# Altium schematic sheet pca10095_sheet2_nrf5340_mcu.SchDoc: PCA10095 - nRF5340 MCU
size A3; Organization: Nordic Semiconductor; DocumentNumber: 2; SheetNumber: 2; SheetTotal: 6; CompanyName: Nordic Semiconductor
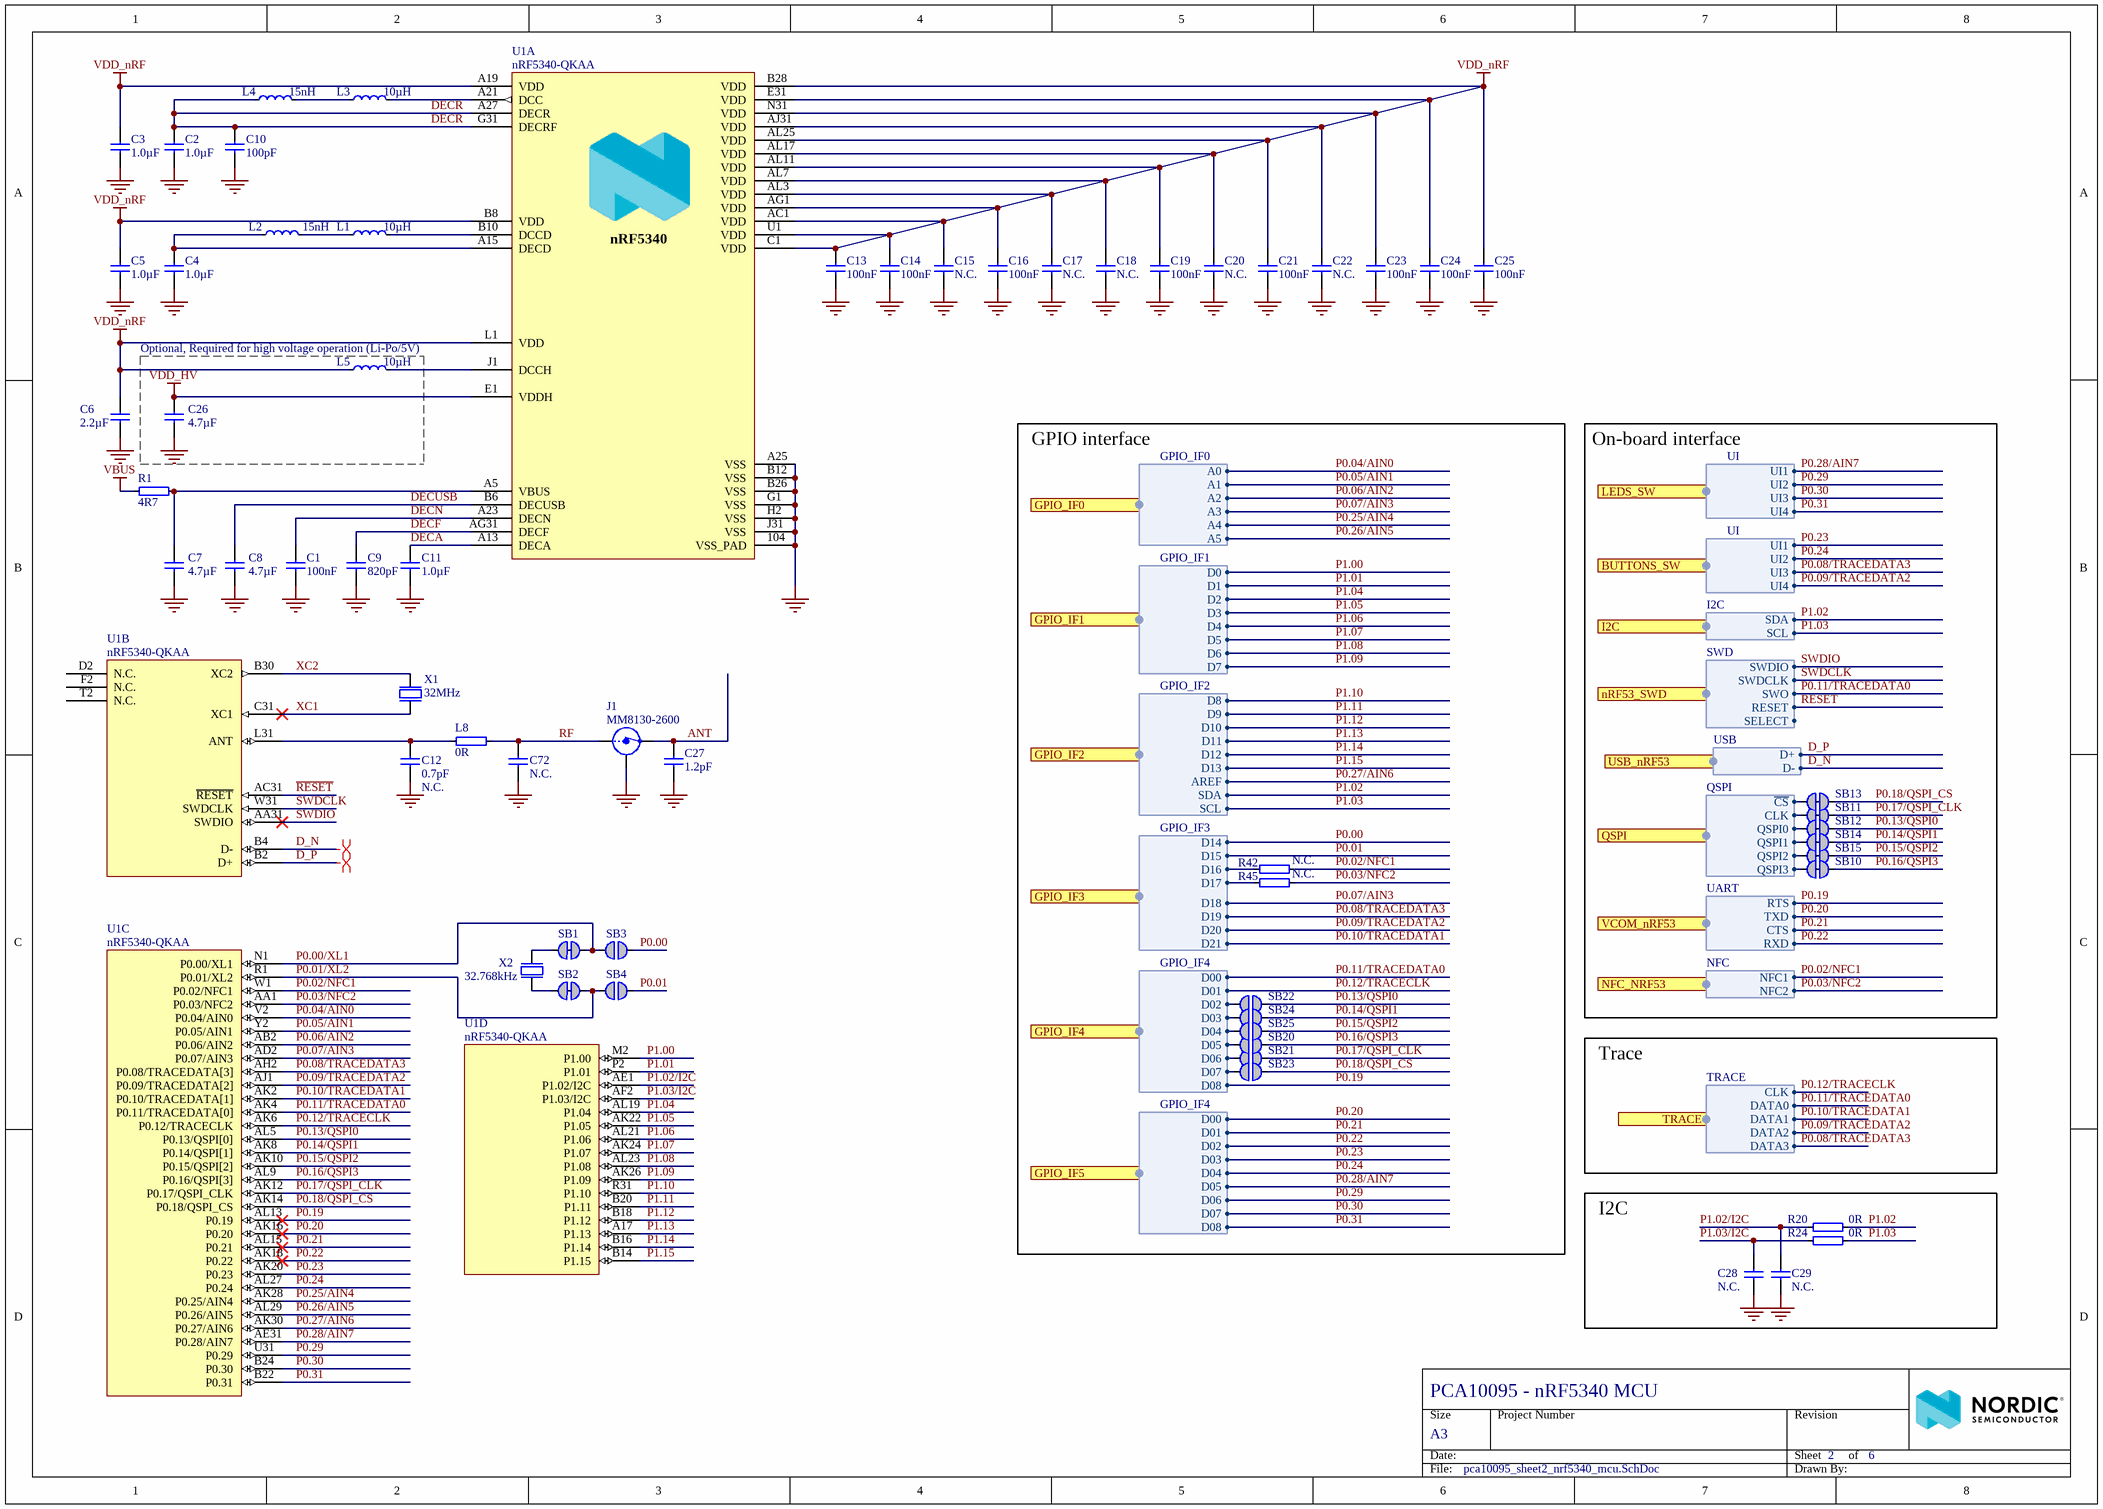
[diagram p0: pca10095_sheet2_nrf5340_mcu.SchDoc]

## Parts
C1  100nF  [CAPC0603X03L_C]
C2  1.0µF  [CAPC1005X04L]
C3  1.0µF  [CAPC1005X04L]
C4  1.0µF  [CAPC1005X04L]
C5  1.0µF  [CAPC1005X04L]
C6  2.2µF  [CAPC1608X06L]
C7  4.7µF  [CAPC1608X06L]
C8  4.7µF  [CAPC1608X06L]
C9  820pF  [CAPC0603X03L_C]
C10  100pF  [CAPC0603X03L_C]
C11  1.0µF  [CAPC1005X04L]
C12  0.7pF  Assembly: N.C.  [CAPC0603X03L_C]
C13  100nF  [CAPC0603X03L_C]
C14  100nF  [CAPC0603X03L_C]
C15  N.C.  [CAPC0603X03L_C]
C16  100nF  [CAPC0603X03L_C]
C17  N.C.  [CAPC0603X03L_C]
C18  N.C.  [CAPC0603X03L_C]
C19  100nF  [CAPC0603X03L_C]
C20  N.C.  [CAPC0603X03L_C]
C21  100nF  [CAPC0603X03L_C]
C22  N.C.  [CAPC0603X03L_C]
C23  100nF  [CAPC0603X03L_C]
C24  100nF  [CAPC0603X03L_C]
C25  100nF  [CAPC0603X03L_C]
C26  4.7µF  [CAPC1608X06L]
C27  1.2pF  [CAPC1005X04L]
C28  N.C.  [CAPC0603X03L_C]
C29  N.C.  [CAPC0603X03L_C]
C72  N.C.  [CAPC0603X03L_C]
J1  MM8130-2600  [COAXIAL-SWF]
L1  10µH  [INDC1608X06L]
L2  15nH  [INDC0603X03L_C]
L3  10µH  [INDC1608X06L]
L4  15nH  [INDC0603X03L_C]
L5  10µH  [INDC1608X06L]
L8  0R  [RESC0603X03L_C]
R1  4R7  [RESC0603X03L_C]
R20  0R  [RESC0603X03L_C]
R24  0R  [RESC0603X03L_C]
R42  N.C.  [RESC0603X03L_C]
R45  N.C.  [RESC0603X03L_C]
SB1  Solderbridge  [Solderbridge_Shorted]  (value not drawn)  (net tie, no BOM)
SB2  Solderbridge  [Solderbridge_Shorted]  (value not drawn)  (net tie, no BOM)
SB3  Solderbridge  [Solderbridge]  (value not drawn)  (no BOM)
SB4  Solderbridge  [Solderbridge]  (value not drawn)  (no BOM)
SB10  Solderbridge  [Solderbridge_Shorted]  (value not drawn)  (net tie, no BOM)
SB11  Solderbridge  [Solderbridge_Shorted]  (value not drawn)  (net tie, no BOM)
SB12  Solderbridge  [Solderbridge_Shorted]  (value not drawn)  (net tie, no BOM)
SB13  Solderbridge  [Solderbridge_Shorted]  (value not drawn)  (net tie, no BOM)
SB14  Solderbridge  [Solderbridge_Shorted]  (value not drawn)  (net tie, no BOM)
SB15  Solderbridge  [Solderbridge_Shorted]  (value not drawn)  (net tie, no BOM)
SB20  Solderbridge  [Solderbridge]  (value not drawn)  (no BOM)
SB21  Solderbridge  [Solderbridge]  (value not drawn)  (no BOM)
SB22  Solderbridge  [Solderbridge]  (value not drawn)  (no BOM)
SB23  Solderbridge  [Solderbridge]  (value not drawn)  (no BOM)
SB24  Solderbridge  [Solderbridge]  (value not drawn)  (no BOM)
SB25  Solderbridge  [Solderbridge]  (value not drawn)  (no BOM)
U1  nRF5340-QKAA  [AQFN40P700X700X85_HS-99N]  (parts A,B,C,D of 4)
X1  32MHz  [BT-XTAL_2016]
X2  32.768kHz  [XTAL_2012]

## Blocks framed on the sheet
Optional, Required for high voltage operation (Li-Po/5V): C26 L5
GPIO interface: R42 R45 SB20-SB25
On-board interface: SB10-SB15
I2C: C28 C29 R20 R24

## Ports
BUTTONS_SW (harness UI), GPIO_IF0 (harness GPIO_IF0), GPIO_IF1 (harness GPIO_IF1), GPIO_IF2 (harness GPIO_IF2), GPIO_IF3 (harness GPIO_IF3), GPIO_IF4 (harness GPIO_IF4), GPIO_IF5 (harness GPIO_IF4), I2C (harness I2C), LEDS_SW (harness UI), NFC_NRF53 (harness NFC), nRF53_SWD (harness SWD), QSPI (harness QSPI), TRACE (harness TRACE), USB_nRF53 (harness USB), VCOM_nRF53 (harness UART)

## Harnesses
QSPI: ~{CS}, QSPI0, CLK, QSPI1, QSPI2, QSPI3
SWD: SWDIO, SWDCLK, SWO, RESET, SELECT
UI: UI4, UI3, UI2, UI1
USB: D+, D-
TRACE: CLK, DATA0, DATA1, DATA3, DATA2
NFC: NFC2, NFC1
UART: RTS, CTS, RXD, TXD
GPIO_IF1: D0, D1, D2, D3, D4, D5, D6, D7
GPIO_IF2: D8, D9, D10, D11, D12, D13, AREF, SDA, SCL
GPIO_IF0: A0, A1, A2, A3, A4, A5
GPIO_IF3: D14, D15, D16, D17, D18, D19, D20, D21
I2C: SCL, SDA
GPIO_IF4: D00, D01, D02, D03, D04, D05, D06, D07, D08

## Nets
GND: C1.2 C2.1 C3.2 C4.1 C5.1 C6.2 C7.2 C8.2 C9.1 C10.2 C11.1 C12.1 C13.2 C14.2 C15.2 C16.2 C17.2 C18.2 C19.2 C20.2 C21.2 C22.2 C23.2 C24.2 C25.2 C26.2 C27.2 C28.1 C29.1 C72.1 J1.2(Shield) U1.104(VSS_PAD) U1.A25(VSS) U1.B12(VSS) U1.B26(VSS) U1.G1(VSS) U1.H2(VSS) U1.J31(VSS) X1.2(GND) X1.4(GND)
VBUS: R1.1
VDD_HV: C26.1 U1.E1(VDDH)
VDD_nRF: C3.1 C5.2 C6.1 C13.1 C14.1 C15.1 C16.1 C17.1 C18.1 C19.1 C20.1 C21.1 C22.1 C23.1 C24.1 C25.1 L5.1 U1.A19(VDD) U1.AC1(VDD) U1.AG1(VDD) U1.AJ31(VDD) U1.AL3(VDD) U1.AL7(VDD) U1.AL11(VDD) U1.AL17(VDD) U1.AL25(VDD) U1.B8(VDD) U1.B28(VDD) U1.C1(VDD) U1.E31(VDD) U1.L1(VDD) U1.N31(VDD) U1.U1(VDD)
ANT: C27.1 J1.3(OUT)
D_N: U1.B4(D-) ; port USB_nRF53.D-
D_P: U1.B2(D+) ; port USB_nRF53.D+
DECA: C11.2 U1.A13(DECA)
DECF: C9.2 U1.AG31(DECF)
DECN: C1.1 U1.A23(DECN)
DECR: C2.2 C10.1 L4.1 U1.A27(DECR) U1.G31(DECRF)
DECUSB: C8.1 U1.B6(DECUSB)
P0.00: SB3.2 ; port GPIO_IF3.D14
P0.00/XL1: SB1.2 SB3.1 U1.N1(P0.00/XL1)
P0.01: SB4.2 ; port GPIO_IF3.D15
P0.01/XL2: SB2.2 SB4.1 U1.R1(P0.01/XL2)
P0.02/NFC1: R42.2 U1.W1(P0.02/NFC1) ; port NFC_NRF53.NFC1
P0.03/NFC2: R45.2 U1.AA1(P0.03/NFC2) ; port NFC_NRF53.NFC2
P0.04/AIN0: U1.V2(P0.04/AIN0) ; port GPIO_IF0.A0
P0.05/AIN1: U1.Y2(P0.05/AIN1) ; port GPIO_IF0.A1
P0.06/AIN2: U1.AB2(P0.06/AIN2) ; port GPIO_IF0.A2
P0.07/AIN3: U1.AD2(P0.07/AIN3) ; port GPIO_IF0.A3, port GPIO_IF3.D18
P0.08/TRACEDATA3: U1.AH2(P0.08/TRACEDATA[3]) ; port BUTTONS_SW.UI3, port TRACE.DATA3, port GPIO_IF3.D19
P0.09/TRACEDATA2: U1.AJ1(P0.09/TRACEDATA[2]) ; port BUTTONS_SW.UI4, port TRACE.DATA2, port GPIO_IF3.D20
P0.10/TRACEDATA1: U1.AK2(P0.10/TRACEDATA[1]) ; port TRACE.DATA1, port GPIO_IF3.D21
P0.11/TRACEDATA0: U1.AK4(P0.11/TRACEDATA[0]) ; port nRF53_SWD.SWO, port TRACE.DATA0, port GPIO_IF4.D00
P0.12/TRACECLK: U1.AK6(P0.12/TRACECLK) ; port TRACE.CLK, port GPIO_IF4.D01
P0.13/QSPI0: SB12.1 SB22.1 U1.AL5(P0.13/QSPI[0])
P0.14/QSPI1: SB14.1 SB24.1 U1.AK8(P0.14/QSPI[1])
P0.15/QSPI2: SB15.1 SB25.1 U1.AK10(P0.15/QSPI[2])
P0.16/QSPI3: SB10.1 SB20.1 U1.AL9(P0.16/QSPI[3])
P0.17/QSPI_CLK: SB11.1 SB21.1 U1.AK12(P0.17/QSPI_CLK)
P0.18/QSPI_CS: SB13.1 SB23.1 U1.AK14(P0.18/QSPI_CS)
P0.19: U1.AL13(P0.19) ; port VCOM_nRF53.RTS, port GPIO_IF4.D08
P0.20: U1.AK16(P0.20) ; port VCOM_nRF53.TXD, port GPIO_IF5.D00
P0.21: U1.AL15(P0.21) ; port VCOM_nRF53.CTS, port GPIO_IF5.D01
P0.22: U1.AK18(P0.22) ; port VCOM_nRF53.RXD, port GPIO_IF5.D02
P0.23: U1.AK20(P0.23) ; port BUTTONS_SW.UI1, port GPIO_IF5.D03
P0.24: U1.AL27(P0.24) ; port BUTTONS_SW.UI2, port GPIO_IF5.D04
P0.25/AIN4: U1.AK28(P0.25/AIN4) ; port GPIO_IF0.A4
P0.26/AIN5: U1.AL29(P0.26/AIN5) ; port GPIO_IF0.A5
P0.27/AIN6: U1.AK30(P0.27/AIN6) ; port GPIO_IF2.AREF
P0.28/AIN7: U1.AE31(P0.28/AIN7) ; port LEDS_SW.UI1, port GPIO_IF5.D05
P0.29: U1.U31(P0.29) ; port LEDS_SW.UI2, port GPIO_IF5.D06
P0.30: U1.B24(P0.30) ; port LEDS_SW.UI3, port GPIO_IF5.D07
P0.31: U1.B22(P0.31) ; port LEDS_SW.UI4, port GPIO_IF5.D08
P1.00: U1.M2(P1.00) ; port GPIO_IF1.D0
P1.01: U1.P2(P1.01) ; port GPIO_IF1.D1
P1.02: R20.1 ; port GPIO_IF2.SDA, port I2C.SDA
P1.02/I2C: C29.2 R20.2 U1.AE1(P1.02/I2C)
P1.03: R24.1 ; port GPIO_IF2.SCL, port I2C.SCL
P1.03/I2C: C28.2 R24.2 U1.AF2(P1.03/I2C)
P1.04: U1.AL19(P1.04) ; port GPIO_IF1.D2
P1.05: U1.AK22(P1.05) ; port GPIO_IF1.D3
P1.06: U1.AL21(P1.06) ; port GPIO_IF1.D4
P1.07: U1.AK24(P1.07) ; port GPIO_IF1.D5
P1.08: U1.AL23(P1.08) ; port GPIO_IF1.D6
P1.09: U1.AK26(P1.09) ; port GPIO_IF1.D7
P1.10: U1.R31(P1.10) ; port GPIO_IF2.D8
P1.11: U1.B20(P1.11) ; port GPIO_IF2.D9
P1.12: U1.B18(P1.12) ; port GPIO_IF2.D10
P1.13: U1.A17(P1.13) ; port GPIO_IF2.D11
P1.14: U1.B16(P1.14) ; port GPIO_IF2.D12
P1.15: U1.B14(P1.15) ; port GPIO_IF2.D13
~{RESET}: U1.AC31(~{RESET}) ; port nRF53_SWD.RESET
RF: C72.2 J1.1(IN) L8.2
SWDCLK: U1.W31(SWDCLK) ; port nRF53_SWD.SWDCLK
SWDIO: U1.AA31(SWDIO) ; port nRF53_SWD.SWDIO
XC1: U1.C31(XC1) X1.1(inp)
XC2: U1.B30(XC2) X1.3(out)
NetC4_2: C4.2 L2.1 U1.A15(DECD)
NetC7_1: C7.1 R1.2 U1.A5(VBUS)
NetC12_2: C12.2 L8.1 U1.L31(ANT)
NetL1_1: L1.1 L2.2
NetL1_2: L1.2 U1.B10(DCCD)
NetL3_1: L3.1 L4.2
NetL3_2: L3.2 U1.A21(DCC)
NetL5_2: L5.2 U1.J1(DCCH)
NetR42_1: R42.1 ; port GPIO_IF3.D16
NetR45_1: R45.1 ; port GPIO_IF3.D17
NetSB1_1: SB1.1 X2.1(inp)
NetSB2_1: SB2.1 X2.2(out)
NetSB10_2: SB10.2 ; port QSPI.QSPI3
NetSB11_2: SB11.2 ; port QSPI.CLK
NetSB12_2: SB12.2 ; port QSPI.QSPI0
NetSB13_2: SB13.2 ; port QSPI.~{CS}
NetSB14_2: SB14.2 ; port QSPI.QSPI1
NetSB15_2: SB15.2 ; port QSPI.QSPI2
NetSB20_2: SB20.2 ; port GPIO_IF4.D05
NetSB21_2: SB21.2 ; port GPIO_IF4.D06
NetSB22_2: SB22.2 ; port GPIO_IF4.D02
NetSB23_2: SB23.2 ; port GPIO_IF4.D07
NetSB24_2: SB24.2 ; port GPIO_IF4.D03
NetSB25_2: SB25.2 ; port GPIO_IF4.D04

Not connected (* = marked no-connect by the designer): U1 D2(N.C.) F2(N.C.) T2(N.C.)

## Layout directives
differential pair: D_N, D_P

## Notes on the sheet
- D22
- D23
- D24
- D25
- D26
- D27
- D28
- D29
- D30
- D31
- Trace
- D32
- D33
- D34
- D35
- D36
- D37
- D38
- D39
- Size
- Date:
- A3
- Project Number
- Sheet         of
- Revision
- File:
- Drawn By:
- (in symbol nRF5340-QKAAAA, part A) nRF5340

## Library data of the parts
C1 C13 C14 C16 C19 C21 C23-C25 = C0201-100n: Capacitor, X5R, ±10%; Part number IPS: 00000001248; Note: 16V; Artikkelnr Noca: N.A.; Part Number: C0201-100n; Manufacturer: *; Manufacturer Part Number: *; LatestRevisionDate: 2017-11-09; Pin Count: 2; Publisher: Nordic Semiconductor; Published: 2014-11-13; Value: 100nF; Footprint Doc: 0201; ComponentLink1URL: *; ComponentLink1Description: Datasheet; ComponentLink2URL: *; ComponentLink2Description: Supplier link; HelpURL: *; Supplier 1: *; Supplier Part Number 1: *; Supplier 2: *; Supplier Part Number 2: *
C2-C4 C11 = C0402-1µ0: Capacitor, X5R, ±5%; Part number IPS: 00000007786; Note: 6.3V; Artikkelnr Noca: 20039235; Part Number: C0402-1µ0; Manufacturer: *; Manufacturer Part Number: *; LatestRevisionDate: 2016-08-22; Pin Count: 2; Publisher: Nordic Semiconductor; Published: 2009-05-08; Value: 1.0µF; Footprint Doc: 0402; ComponentLink1URL: *; ComponentLink1Description: Datasheet; ComponentLink2URL: *; ComponentLink2Description: Supplier link; HelpURL: *; Supplier 1: Digi-Key; Supplier Part Number 1: 1276-1444-1-ND; Supplier 2: *; Supplier Part Number 2: *
C5 = C0402-1µ0: Capacitor, X5R, ±5%, 6.3V; Part number IPS: 00000007786; Artikkelnr Noca: 20039235; Part Number: C0402-1µ0; Manufacturer: *; Manufacturer Part Number: *; LatestRevisionDate: 2016-08-22; Pin Count: 2; Publisher: Nordic Semiconductor; Published: 2009-05-08; Value: 1.0µF; Note: 6.3V; Footprint Doc: 0402; ComponentLink1URL: *; ComponentLink1Description: Datasheet; ComponentLink2URL: *; ComponentLink2Description: Supplier link; HelpURL: *; Supplier 1: Digi-Key; Supplier Part Number 1: 1276-1444-1-ND; Supplier 2: *; Supplier Part Number 2: *
C6 = C0603-2µ2: Capacitor, X7R, ±10%; Part number IPS: N.A.; Note: 6.3V; Artikkelnr Noca: 20039322; Part Number: C0603-2µ2; Manufacturer: *; Manufacturer Part Number: *; LatestRevisionDate: 2016-10-10; Pin Count: 2; Publisher: Nordic Semiconductor; Published: 2009-05-08; Value: 2.2µF; Footprint Doc: 0603; ComponentLink1URL: *; ComponentLink1Description: Datasheet; ComponentLink2URL: *; ComponentLink2Description: Supplier link; HelpURL: *; Supplier 1: *; Supplier Part Number 1: *; Supplier 2: *; Supplier Part Number 2: *
C7 C8 C26 = C0603-4µ7-10V-X7S: Capacitor, X7S, ±10%; Part number IPS: N.A.; Note: 10V; Artikkelnr Noca: 20030013; Part Number: C0603-4µ7-10V-X7S; LatestRevisionDate: 2016-08-15; Pin Count: 2; Publisher: Nordic Semiconductor; Published: 2016-08-15; Value: 4.7µF; Footprint Doc: 0603; Manufacturer: *; Manufacturer Part Number: *; ComponentLink1URL: *; ComponentLink1Description: Datasheet; ComponentLink2URL: *; ComponentLink2Description: Supplier link; HelpURL: *; Supplier 1: Digi-Key; Supplier Part Number 1: 445-14258-1-ND; Supplier 2: *; Supplier Part Number 2: *
C9 = C0201-820p: Capacitor, X7R, ±10%; Part number IPS: 00000001249; Note: 25V; Artikkelnr Noca: N.A.; Part Number: C0201-820p; Manufacturer: *; Manufacturer Part Number: *; LatestRevisionDate: 2017-11-09; Pin Count: 2; Publisher: Nordic Semiconductor; Published: 2014-11-13; Value: 820pF; Footprint Doc: 0201; ComponentLink1URL: *; ComponentLink1Description: Datasheet; ComponentLink2URL: *; ComponentLink2Description: Supplier link; HelpURL: *; Supplier 1: *; Supplier Part Number 1: *; Supplier 2: *; Supplier Part Number 2: *
C10 = C0201-100p: Capacitor, NP0, ±2%; Part number IPS: 00000007853; Note: 25V; Artikkelnr Noca: N.A.; Part Number: C0201-100p; Manufacturer: *; Manufacturer Part Number: *; LatestRevisionDate: 2017-11-09; Pin Count: 2; Publisher: Nordic Semiconductor; Published: 2014-11-13; Value: 100pF; Footprint Doc: 0201; ComponentLink1URL: *; ComponentLink1Description: Datasheet; ComponentLink2URL: *; ComponentLink2Description: Supplier link; HelpURL: *; Supplier 1: *; Supplier Part Number 1: *; Supplier 2: *; Supplier Part Number 2: *
C12 = C0201-0.7p: Capacitor, NP0, ±0.05pF; Note: 50V; Artikkelnr Noca: N.A.; Part Number: C0201-0.7p; Manufacturer: *; Manufacturer Part Number: *; LatestRevisionDate: 2018-10-22; Pin Count: 2; Publisher: Nordic Semiconductor; Published: 2014-11-13; Value: 0.7pF; Footprint Doc: 0201; ComponentLink1URL: *; ComponentLink1Description: Datasheet; ComponentLink2URL: *; ComponentLink2Description: Supplier link; HelpURL: *; Supplier 1: *; Supplier Part Number 1: *; Supplier 2: *; Supplier Part Number 2: *; Part number IPS: N.A.
C15 C17 C18 C20 C22 = C0201-N.C.: Not mounted; Note: Chip Cap; Artikkelnr Noca: N.A.; Assembly: Not mounted; Part Number: C0201-N.C.; Manufacturer: *; Manufacturer Part Number: *; LatestRevisionDate: 2014-11-13; Pin Count: 2; Publisher: Nordic Semiconductor; Published: 2014-11-13; Value: N.C.; Footprint Doc: 0201; ComponentLink1URL: *; ComponentLink1Description: Datasheet; ComponentLink2URL: *; ComponentLink2Description: Supplier link; HelpURL: *; Supplier 1: *; Supplier Part Number 1: *; Supplier 2: *; Supplier Part Number 2: *; Part number IPS: N.A.
C27 = C0402-1.2p: Capacitor, NP0, ±0.1pF; Part number IPS: 00000005410; Note: 50V; Artikkelnr Noca: 20029157; Artikkelnr Simpro: N.A.; Part Number: C0402-1.2p; Manufacturer: *; Manufacturer Part Number: *; Datasheet: *; LatestRevisionDate: 2011-05-11; Pin Count: 2; Publisher: Nordic Semiconductor; Published: 2009-05-08; Value: 1.2pF; Supplier: *; Supplier part number: *; 2nd source Supplier: *; 2nd source part number: *; Footprint Doc: 0402
C28 C29 = C0201-N.C.: Not mounted; Assembly: Not mounted; Note: Chip Cap; Artikkelnr Noca: N.A.; Part Number: C0201-N.C.; Manufacturer: *; Manufacturer Part Number: *; Footprint Doc: 0201; LatestRevisionDate: 2014-11-13; Pin Count: 2; Publisher: Nordic Semiconductor; Published: 2014-11-13; Value: N.C.; Part number IPS: N.A.; ComponentLink1URL: *; ComponentLink1Description: Datasheet; ComponentLink2URL: *; ComponentLink2Description: Supplier link; HelpURL: *; Supplier 1: *; Supplier Part Number 1: *; Supplier 2: *; Supplier Part Number 2: *
C72 = C0201-N.C.: Not mounted; Note: Chip Cap; Assembly: Not mounted; Artikkelnr Noca: N.A.; Part Number: C0201-N.C.; LatestRevisionDate: 2014-11-13; Pin Count: 2; Publisher: Nordic Semiconductor; Published: 2014-11-13; Value: N.C.; Footprint Doc: 0201; Manufacturer: *; Manufacturer Part Number: *; Part number IPS: N.A.; ComponentLink1URL: *; ComponentLink1Description: Datasheet; ComponentLink2URL: *; ComponentLink2Description: Supplier link; HelpURL: *; Supplier 1: *; Supplier Part Number 1: *; Supplier 2: *; Supplier Part Number 2: *
J1 = MM8130-2600: Coaxial Connector with Switch; Manufacturer: Murata; 2nd source part number: 81-MM8130-2600RA2; Artikkelnr Noca: 55029011; Artikkelnr Simpro: N.A.; Part Number: MM8130-2600; Manufacturer Part Number: MM8130-2600; Datasheet: http://www.murata.com/products/catalog/pdf/o33e.pdf; LatestRevisionDate: 2014-04-24; Pin Count: 3; Publisher: Nordic Semiconductor; Published: 2014-04-24; Value: MM8130-2600; Note: *; Supplier: Digi-Key; Supplier part number: 490-4981-1-ND; 2nd source Supplier: Mouser; Footprint Doc: COAXIAL-SWF
L1 L3 L5 = L0603-10µ-TDK: Inductor, 250mA, ±20%, 1.05ohm. -55°C ~ 125°C; Manufacturer: TDK; Manufacturer Part Number: MLZ1608M100WTD25; Part Number: L0603-10µ-TDK; LatestRevisionDate: 2012-09-19; Pin Count: 2; Publisher: Nordic Semiconductor; Published: 2019-05-06; Value: 10µH; Note: *; Artikkelnr Noca: *; Footprint Doc: 0603; ComponentLink1URL: *; ComponentLink1Description: Datasheet; ComponentLink2URL: *; ComponentLink2Description: Supplier link; HelpURL: https://product.tdk.com/info/en/catalog/datasheets/inductor_automotive_decoupling_mlz1608_en.pdf; Supplier 1: Digi-Key; Supplier Part Number 1: 445-175588-1-ND; Supplier 2: Mouser; Supplier Part Number 2: 810-MLZ1608M100WTD25; Part number IPS: *
L2 L4 = L0201-15n: Inductor, 250mA, ±5%; Manufacturer: Murata; Manufacturer Part Number: LQP03TN15NJ02D; Note: High frequency chip inductor ±10%; Artikkelnr Noca: N.A.; Part Number: L0201-15n; LatestRevisionDate: 2013-04-10; Pin Count: 2; Publisher: Nordic Semiconductor; Published: 2013-04-10; Value: 15nH; Footprint Doc: 0201; ComponentLink1URL: http://search.murata.co.jp/Ceramy/image/img/P02/JELF243C-0015.pdf; ComponentLink1Description: Datasheet; ComponentLink2URL: *; ComponentLink2Description: Supplier link; HelpURL: *; Supplier 1: Digi-Key; Supplier Part Number 1: 490-5570-1-ND; Supplier 2: *; Supplier Part Number 2: *; Part number IPS: N.A.
L8 R20 R24 = R0201-0R: Resistor, ±5%, 0.05W; Part number IPS: 00000003245; Note: Chip Res 5%; Artikkelnr Noca: N.A.; Part Number: R0201-0R; Manufacturer: *; Manufacturer Part Number: *; ComponentLink1URL: *; ComponentLink1Description: Datasheet; ComponentLink2URL: *; ComponentLink2Description: Supplier link; HelpURL: *; Footprint Doc: 0201; LatestRevisionDate: 2017-11-09; Pin Count: 2; Publisher: Nordic Semiconductor; Published: 2014-11-13; Value: 0R; Supplier 1: *; Supplier Part Number 1: *; Supplier 2: *; Supplier Part Number 2: *
R1 = R0201-4R7: Resistor, ±1%, 0.05W; Note: Chip Res 1%; Artikkelnr Noca: N.A.; Part Number: R0201-4R7; Manufacturer: *; Manufacturer Part Number: *; ComponentLink1URL: *; ComponentLink1Description: Datasheet; ComponentLink2URL: *; ComponentLink2Description: Supplier link; HelpURL: *; Footprint Doc: 0201; LatestRevisionDate: 2014-11-13; Pin Count: 2; Publisher: Nordic Semiconductor; Published: 2014-11-13; Value: 4R7; Supplier 1: *; Supplier Part Number 1: *; Supplier 2: *; Supplier Part Number 2: *; Part number IPS: N.A.
R42 R45 = R0201-N.C.: Not mounted; Note: Chip Res; Artikkelnr Noca: N.A.; Part Number: R0201-N.C.; Manufacturer: *; Manufacturer Part Number: *; Footprint Doc: 0201; LatestRevisionDate: 2014-11-13; Pin Count: 2; Publisher: Nordic Semiconductor; Published: 2014-11-13; Value: N.C.; Part number IPS: N.A.; ComponentLink1URL: *; ComponentLink1Description: Datasheet; ComponentLink2URL: *; ComponentLink2Description: Supplier link; HelpURL: *; Supplier 1: *; Supplier Part Number 1: *; Supplier 2: *; Supplier Part Number 2: *
SB1 SB2 SB10-SB15 = Solderbridge Shorted: Shorted Solderbridge; Artikkelnr Noca: N.A.; Part Number: Solderbridge Shorted; Manufacturer: *; Manufacturer Part Number: *; LatestRevisionDate: 2012-08-07; Pin Count: 2; Publisher: Nordic Semiconductor; Published: 2012-08-07; Value: Solderbridge; Note: *; Footprint Doc: Solderbridge_Shorted
  SB1 SB2: Datasheet: *; Supplier: *; Supplier part number: *; 2nd source Supplier: *; 2nd source part number: *; Artikkelnr Simpro: N.A.
  SB10-SB15: Part number IPS: N.A.; ComponentLink1URL: *; ComponentLink1Description: Datasheet; ComponentLink2URL: *; ComponentLink2Description: Supplier link; HelpURL: *; Supplier 1: *; Supplier Part Number 1: *; Supplier 2: *; Supplier Part Number 2: *
SB3 SB4 SB20-SB25 = Solderbridge: Artikkelnr Noca: N.A.; Part Number: Solderbridge; Manufacturer: *; Manufacturer Part Number: *; LatestRevisionDate: 2009-12-14; Pin Count: 2; Publisher: Nordic Semiconductor; Published: 2009-12-14; Value: Solderbridge; Note: *; Footprint Doc: Solderbridge
  SB3 SB4: Datasheet: *; Supplier: *; Supplier part number: *; 2nd source Supplier: *; 2nd source part number: *; Artikkelnr Simpro: N.A.
  SB20-SB25: Part number IPS: N.A.; ComponentLink1URL: *; ComponentLink1Description: Datasheet; ComponentLink2URL: *; ComponentLink2Description: Supplier link; HelpURL: *; Supplier 1: *; Supplier Part Number 1: *; Supplier 2: *; Supplier Part Number 2: *
U1 = nRF5340-QKAAAA: Multi-protocol Bluetooth Low Energy, IEEE 802.15.4, ANT and 2.4GHz proprietary system-on-chip; Manufacturer: Nordic Semiconductor; Artikkelnr Noca: N.A.; Part Number: nRF5340-QKAAAA; Manufacturer Part Number: *; Footprint Doc: AQFN-98; LatestRevisionDate: 2019-03-28; Pin Count: 98; Publisher: Nordic Semiconductor; Published: 2017-01-09; Value: nRF5340-QKAA; Note: *; Part number IPS: N.A.; ComponentLink1URL: *; ComponentLink1Description: Datasheet; ComponentLink2URL: *; ComponentLink2Description: Supplier link; HelpURL: *; Supplier 1: Nordic Semiconductor; Supplier Part Number 1: nRF5340-QKAAAA; Supplier 2: *; Supplier Part Number 2: *
X1 = XTAL_SMD2016_32MHz_8pF_Kyocera_HT: XTAL SMD 2016, 32MHz, Cl=8pF, ±40ppm, -40°C ~ 105°C; Manufacturer Part Number: CX2016DB32000D0WRRC1; Note: XTAL SMD 32.000MHz; Artikkelnr Noca: N.A.; Part Number: XTAL_SMD2016_32MHz_8pF_Kyocera_HT; Manufacturer: Kyocera; LatestRevisionDate: 2015-12-22; Pin Count: 4; Publisher: Nordic Semiconductor; Published: 2015-12-23; Value: 32MHz; Footprint Doc: XTAL_2016; Part number IPS: N.A.; ComponentLink1URL: *; ComponentLink1Description: Datasheet; ComponentLink2URL: *; ComponentLink2Description: Supplier link; HelpURL: http://projecttools.nordicsemi.no/confluence/download/attachments/16544873/CX2016DB32000D0WRRC1%2015236-00.pdf?version=1&modificationDate=1441719736227&api=v2; Supplier 1: *; Supplier Part Number 1: *; Supplier 2: *; Supplier Part Number 2: *
X2 = XTAL_SMD2012_32.768kHz_9pF_General: XTAL SMD 2012, 32.768kHz, Cl=9pF, Total Tol: ±50ppm; Note: XTAL SMD 32.768kHz; Artikkelnr Noca: N.A.; Part Number: XTAL_SMD2012_32.768kHz_9pF_General; Manufacturer: *; Manufacturer Part Number: *; LatestRevisionDate: 2017-01-11; Pin Count: 2; Publisher: Nordic Semiconductor; Published: 2016-08-19; Value: 32.768kHz; Footprint Doc: XTAL_2012; Part number IPS: N.A.; ComponentLink1URL: *; ComponentLink1Description: Datasheet; ComponentLink2URL: *; ComponentLink2Description: Supplier link; HelpURL: *; Supplier 1: *; Supplier Part Number 1: *; Supplier 2: *; Supplier Part Number 2: *